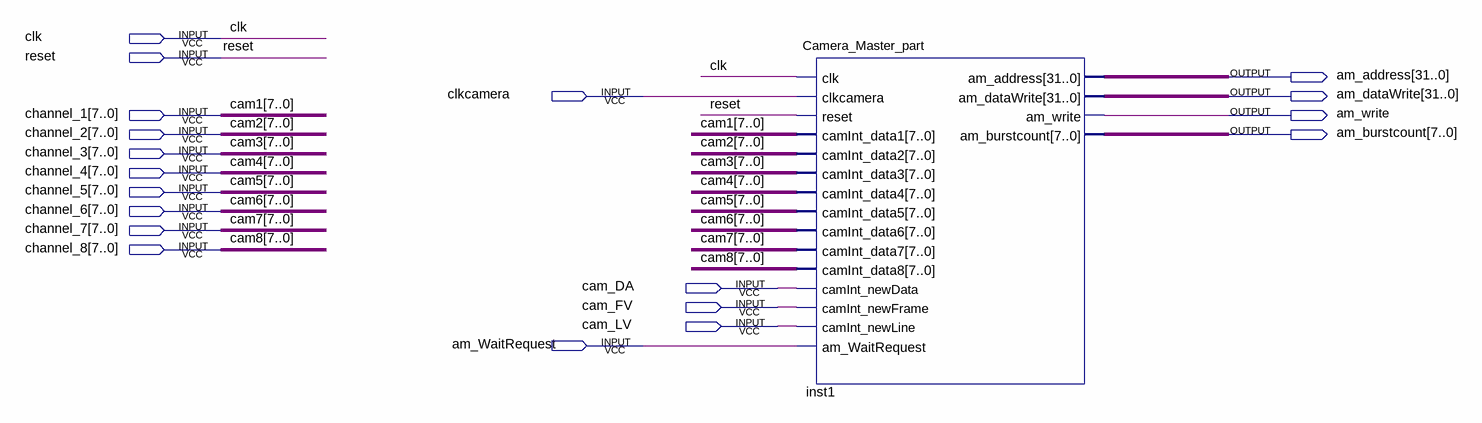
[diagram p0: schematic sheet]
// Quartus schematic Camera_Interface_block.bdf as structural Verilog: 1 symbols, 19 pins
module Camera_Interface_block (
  input  clk,
  input  reset,
  input  clkcamera,
  input  [7:0] channel_1,
  input  [7:0] channel_2,
  input  [7:0] channel_3,
  input  [7:0] channel_4,
  input  [7:0] channel_5,
  input  [7:0] channel_6,
  input  [7:0] channel_7,
  input  [7:0] channel_8,
  input  cam_DA,
  input  cam_FV,
  input  cam_LV,
  input  am_WaitRequest,
  output [31:0] am_address,
  output [31:0] am_dataWrite,
  output am_write,
  output [7:0] am_burstcount
);

  Camera_Master_part inst1 (
    .clk(clk), .clkcamera(clkcamera), .reset(reset), .camInt_data1(channel_1), .camInt_data2(channel_2),
    .camInt_data3(channel_3), .camInt_data4(channel_4), .camInt_data5(channel_5), .camInt_data6(channel_6),
    .camInt_data7(channel_7), .camInt_data8(channel_8), .camInt_newData(cam_DA), .camInt_newFrame(cam_FV),
    .camInt_newLine(cam_LV), .am_WaitRequest(am_WaitRequest), .am_address(am_address),
    .am_dataWrite(am_dataWrite), .am_write(am_write), .am_burstcount(am_burstcount));

  // Other names for the same wires on the sheet: cam1[7:0] = channel_1; cam2[7:0] = channel_2; cam3[7:0] = channel_3;
  //   cam4[7:0] = channel_4; cam5[7:0] = channel_5; cam6[7:0] = channel_6; cam7[7:0] = channel_7;
  //   cam8[7:0] = channel_8
endmodule
